# Altium schematic sheet 01_MAIN.SchDoc
size A4; SheetNumber: 2; SheetTotal: 3
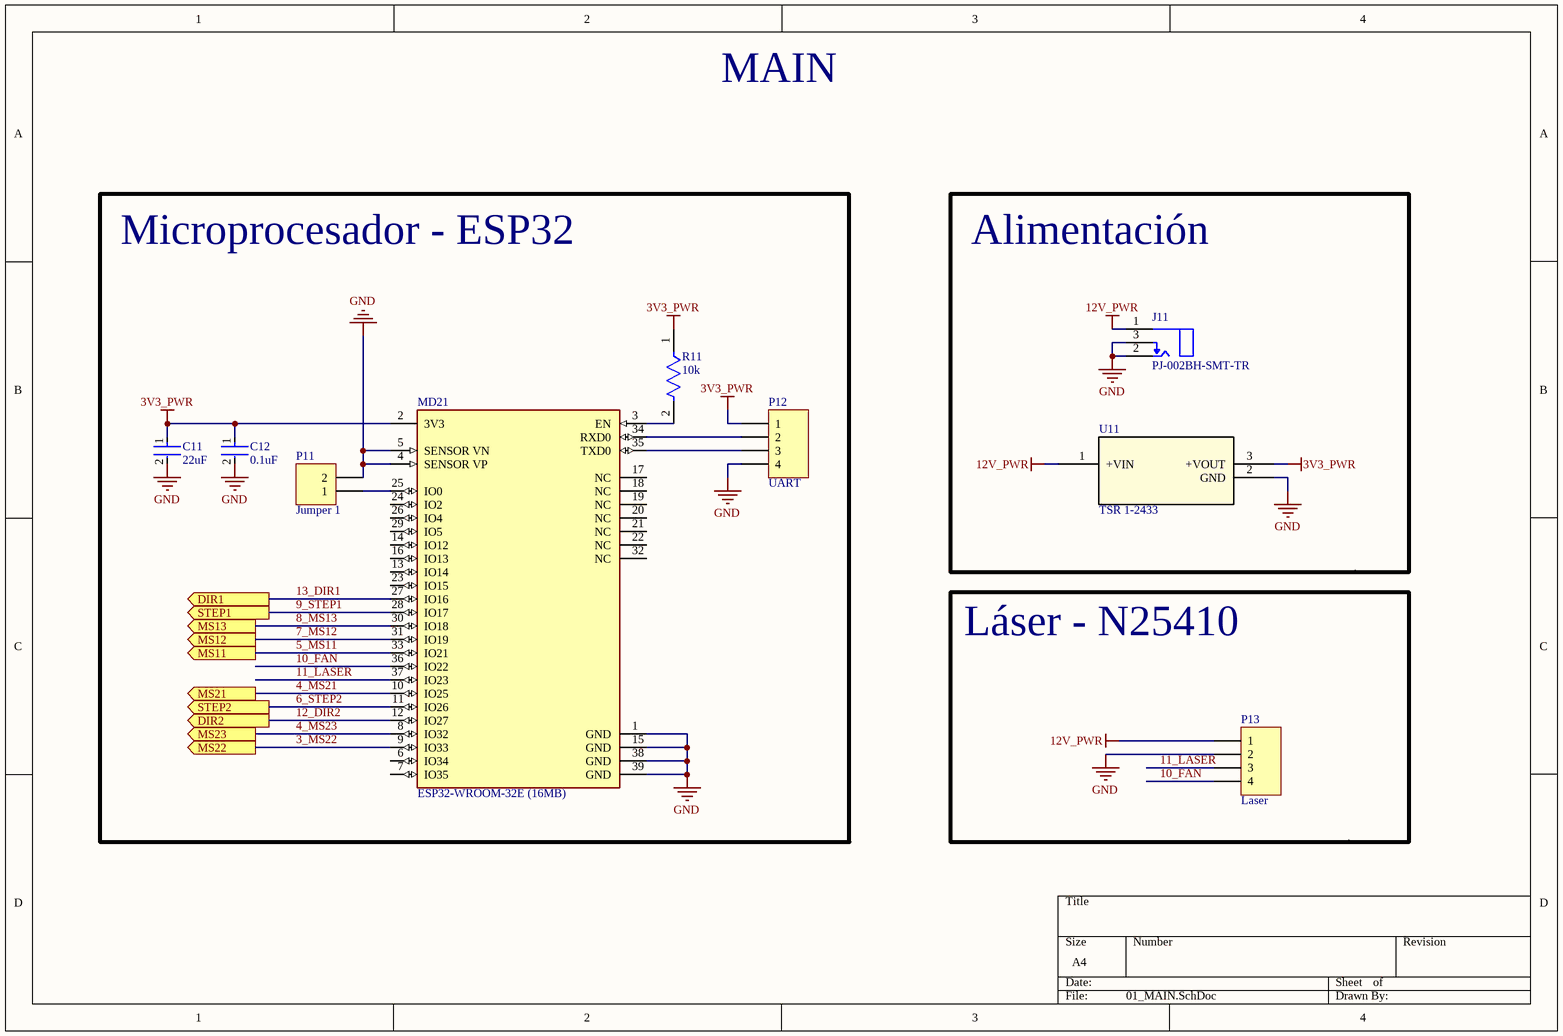
[diagram p0: 01_MAIN.SchDoc]

## Parts
C11  22uF  [FP-0603-L_1_6_0_15-W_0_81-MFG]
C12  0.1uF  [FP-CC0603-DA-IPC_A]
J11  PJ-002BH-SMT-TR  [FP-PJ-002BH-SMT-TR-MFG]
MD21  ESP32-WROOM-32E (16MB)  [FP-ESP32-WROOM-32E_16MB-MFG]
P11  Jumper 1  [HDR1X2]
P12  UART  [HDR1X4]
P13  Laser  [HDR1X4]
R11  10k  [FP-RC0603-0_55-IPC_C]
U11  TSR 1-2433  [TSR1-SINGLE_TRP]

## Blocks framed on the sheet
Microprocesador - ESP32: C11 C12 MD21 P11 P12 R11
Alimentación: J11 U11
Láser - N25410: P13

## Ports
DIR1 (out, see GENERAL_DIAGRAMS[2B], 02_STEPPERS[1B]), DIR2 (out, see GENERAL_DIAGRAMS[2B], 02_STEPPERS[3B]), MS11 (out, see GENERAL_DIAGRAMS[2B], 02_STEPPERS[1B]), MS12 (out, see GENERAL_DIAGRAMS[2B], 02_STEPPERS[1B]), MS13 (out, see GENERAL_DIAGRAMS[2B], 02_STEPPERS[1B]), MS21 (out, see GENERAL_DIAGRAMS[2B], 02_STEPPERS[3B]), MS22 (out, see GENERAL_DIAGRAMS[2B], 02_STEPPERS[3B]), MS23 (out, see GENERAL_DIAGRAMS[2C], 02_STEPPERS[3B]), STEP1 (out, see GENERAL_DIAGRAMS[2B], 02_STEPPERS[1B]), STEP2 (out, see GENERAL_DIAGRAMS[2B], 02_STEPPERS[3B])

## Nets
3V3_PWR: C11.1 C12.1 MD21.2(3V3) P12.1 R11.1 U11.3(+VOUT)
12V_PWR: J11.1 P13.1 U11.1(+VIN)
GND: C11.2 C12.2 J11.2 J11.3 MD21.1(GND) MD21.4(SENSOR_VP) MD21.5(SENSOR_VN) MD21.15(GND) MD21.38(GND) MD21.39(GND) P11.2 P12.4 P13.2 U11.2(GND)
3_MS22: MD21.9(IO33) ; port MS22
4_MS21: MD21.10(IO25) ; port MS21
4_MS23: MD21.8(IO32) ; port MS23
5_MS11: MD21.33(IO21) ; port MS11
6_STEP2: MD21.11(IO26) ; port STEP2
7_MS12: MD21.31(IO19) ; port MS12
8_MS13: MD21.30(IO18) ; port MS13
9_STEP1: MD21.28(IO17) ; port STEP1
10_FAN: MD21.36(IO22) P13.4
11_LASER: MD21.37(IO23) P13.3
12_DIR2: MD21.12(IO27) ; port DIR2
13_DIR1: MD21.27(IO16) ; port DIR1
NetMD21_3: MD21.3(EN) R11.2
NetMD21_25: MD21.25(IO0) P11.1
NetMD21_34: MD21.34(RXD0) P12.2
NetMD21_35: MD21.35(TXD0) P12.3

Not connected (* = marked no-connect by the designer): MD21 6(IO34) 7(IO35) 13(IO14) 14(IO12) 16(IO13) 17(NC) 18(NC) 19(NC) 20(NC) 21(NC) 22(NC) 23(IO15) 24(IO2) 26(IO4) 29(IO5) 32(NC)

## Notes on the sheet
- MAIN

## Library data of the parts
C11 = CMP-04427-003008-1: General Purpose Ceramic Capacitor, 0603, 22uF, 20%, X5R, 15%, 10V; Manufacturer: Kyocera AVX; Manufacturer Part Number: 0603ZD226MAT2A; Capacitance: 22uF; Voltage Rating (DC): 10V; Tolerance: 20%; Case/Package: 0603; RoHS Compliant: Yes; Dielectric: X5R; Supplier: Mouser; Supplier Part Number: 581-0603ZD226MAT2A; RoHS: Yes; Category: Ceramic Capacitors; Stock: 77; Pricing: 1=0,58, 10=0,311, 50=0,311, 100=0,2, 1000=0,169, 10000=0,138 (USD); Value: 22uF
C12 = CMP-03422-001490-1: CAP CER 0.1UF 50V X7R 0603; Manufacturer: Yageo; Manufacturer Part Number: CC0603JRX7R9BB104; Capacitance: 100nF; Tolerance: 5%; Value: 100nF; Number of Pins: 2; Depth: 0.8mm; Weight: 7.1E-05oz; Radiation Hardening: No; Case Code (Metric): 1608; Dielectric: X7R; Max Operating Temperature: 125°C; Voltage Rating (DC): 50V; Case/Package: 0603; Halogen Free: Halogen Free; Mount: Surface Mount; Lead Free: Lead Free; Termination: SMD/SMT; RoHS Compliant: Yes; Length: 1.6mm; Series: CC; Resistor Type: Ceramic; Case Code (Imperial): 0603; Construction: Flat; Width: 0.031inch; Height: 0.8mm; Voltage Rating: 50V; Min Operating Temperature: -55°C; Thickness: 0.035inch; Packaging: Tape and Reel; Supplier: Mouser; Supplier Part Number: 603-CC603JRX7R9BB104; RoHS: Yes; Category: Ceramic Capacitors; Stock: 7435233; Pricing: 1=0,1, 10=0,04, 50=0,04, 100=0,024, 1000=0,018, 10000=0,009 (USD); Mounting Technology: Surface Mount; Pins: 2; ComponentLink1URL: https://datasheet.ciiva.com/11465/upy-gphc-x7r-6-3v-to-50v-8-11465038.pdf?src-supplier=Avnet; ComponentLink1Description: https://datasheet.ciiva.com/11465/upy-gphc-x7r-6-3v-to-50v-8-11465038.pdf?src-supplier=Avnet
J11 = CMP-2000-06897-2: CONN PWR JACK 2.5X5.5MM SOLDER; Manufacturer: CUI Inc; Current Rating: 5A; Standoff Height: 0.1mm; Voltage Rating: 24V; Conn Gender: Male; Conn Orientation: Right Angle; Number Of Contacts: 3; Temperature Range Low: -25°C; Category: Conn; Package: 0; Device Class L2: Power Connectors; Contact Material: Nickel,Silver; Automotive: No; Mouser Description: 2.5 mm Center Pin, 5.0 A, Right Angle, Surface Mount (SMT), Dc Power Jack Connector; Device Class L3: unset; ComponentLink2URL: https://www.cuidevices.com/product/resource/digikeypdf/pj-002bh-smt-tr.pdf; Octopart: https://octopart.com/pj-002bh-smt-tr-cui-25947151; Manufacturer Part Number: PJ-002BH-SMT-TR; Lead Free: Yes; ComponentLink2Description: Datasheet; Digikey Description: CONN PWR JACK 2.5X5.5MM SOLDER; Height: 11.43mm; Temperature: -25°C to +85°C; RoHS: TRUE; Device Class L1: Connectors; Temperature Range High: +85°C
MD21 = CMP-194065-000027-1: RX TXRX MOD WIFI TRACE ANT SMD
P11 = Header 2: Header, 2-Pin; LatestRevisionDate: 17-Jul-2002; LatestRevisionNote: Re-released for DXP Platform.; Publisher: Altium Limited
P12 P13 = Header 4: Header, 4-Pin; LatestRevisionDate: 17-Jul-2002; LatestRevisionNote: Re-released for DXP Platform.; Publisher: Altium Limited
R11 = CMP-2100-03664-2: RES 10K OHM 1% 1/10W 0603; Manufacturer: Yageo; Manufacturer Part Number: RC0603FR-0710KL; Voltage Rating: 75V; Voltage Rating (DC): 50V; Resistance: 10kR; Power Rating: 100mW; Temperature Coefficient: 100ppm/°C; Value: 10kR; Depth: 0.8mm; Termination: SMD/SMT; Resistor Type: Thick Film; Series: RC; Construction: Rectangular; Features: Moisture Resistant; Packaging: Tape and Reel; Min Operating Temperature: -55°C; Number of Terminations: 2; Lead Pitch: 0.3mm; RoHS Compliant: Yes; Case/Package: 0603; Resistance Tolerance: 1%; Military Standard: Not; Weight: 7.1E-05oz; Number of Pins: 2; Tolerance: 1%; Length: 1.6mm; Case Code (Imperial): 0603; Lead Free: Lead Free; Width: 0.8mm; Max Power Dissipation: 100mW; Height: 0.45mm; Max Operating Temperature: 155°C; Case Code (Metric): 1608; Size Code: 0603; Supplier: Future Electronics; Supplier Part Number: 3349388; RoHS: Yes; Category: Chip SMD Resistors; Stock: 252943; Pricing: 1=0,1, 20=0,0661, 100=0,048, 500=0,0298, 2500=0,0116 (USD); Pins: 2; Reach SVHC Compliant: No
U11 = CMP-2000-05426-2: NexarPartId: 9539342; Manufacturer: Traco Power; Nominal Output Voltage: 3.3V; Max Input Voltage: 36V; Max Output Power: 3.3W; Min Input Voltage: 4.75V; Nominal Supply Current: 1mA; Output Type: Fixed; Max Output Current: 1A; Min Input Voltage (DC): 5.5V; Efficiency: 79%; Number of Outputs: 1; Isolation: Isolated; Max Input Voltage (DC): 32V; Switching Frequency: 500kHz; Radiation Hardening: No; REACH SVHC: No SVHC; Mount: Through Hole; Height: 10.2mm; Max Operating Temperature: 85°C; RoHS: Compliant; Output Power: 3.3W; Min Supply Voltage: 4.75V; Weight: 1.9g; Power Rating: 3.3W; Number of Pins: 3; Output Current: 1A; Min Operating Temperature: -40°C; Length: 11.7mm; Case/Package: SIP; Output Voltage: 3.3V; Max Supply Voltage: 36V; Depth: 7.6mm; Width: 7.6mm; Supplier: Mouser; Supplier Part Number: 495-TSR-1-2433; Manufacturer Part Number: TSR1-2433; Category: Uncategorized; Stock: 10749; Pricing: 1=6,15, 10=5,97, 50=5,61, 100=5,44, 1000=4,74, 10000=4,74 (USD); Mounting Technology: Through Hole; Pins: 3; Series: TSR 1; Voltage - Output 1: 3.3V; Features: SCP; Max Power Dissipation: 3.3W; RoHS Compliant: Yes; Reach SVHC Compliant: No; ComponentLink1URL: https://datasheet.ciiva.com/26336/156671-da-01-en-dc-dc-wandler-1a-tsr-1-2433-26336397.pdf?src-supplier=Conrad; ComponentLink1Description: https://datasheet.ciiva.com/26336/156671-da-01-en-dc-dc-wandler-1a-tsr-1-2433-26336397.pdf?src-supplier=Conrad; ComponentLink2URL: https://datasheet.ciiva.com/3355/tsr1-eng-tds-3355819.pdf?src-supplier=Distrelec; ComponentLink2Description: https://datasheet.ciiva.com/3355/tsr1-eng-tds-3355819.pdf?src-supplier=Distrelec